# EAGLE design SD1-37 Rev1 (EAGLE 7.6.0)
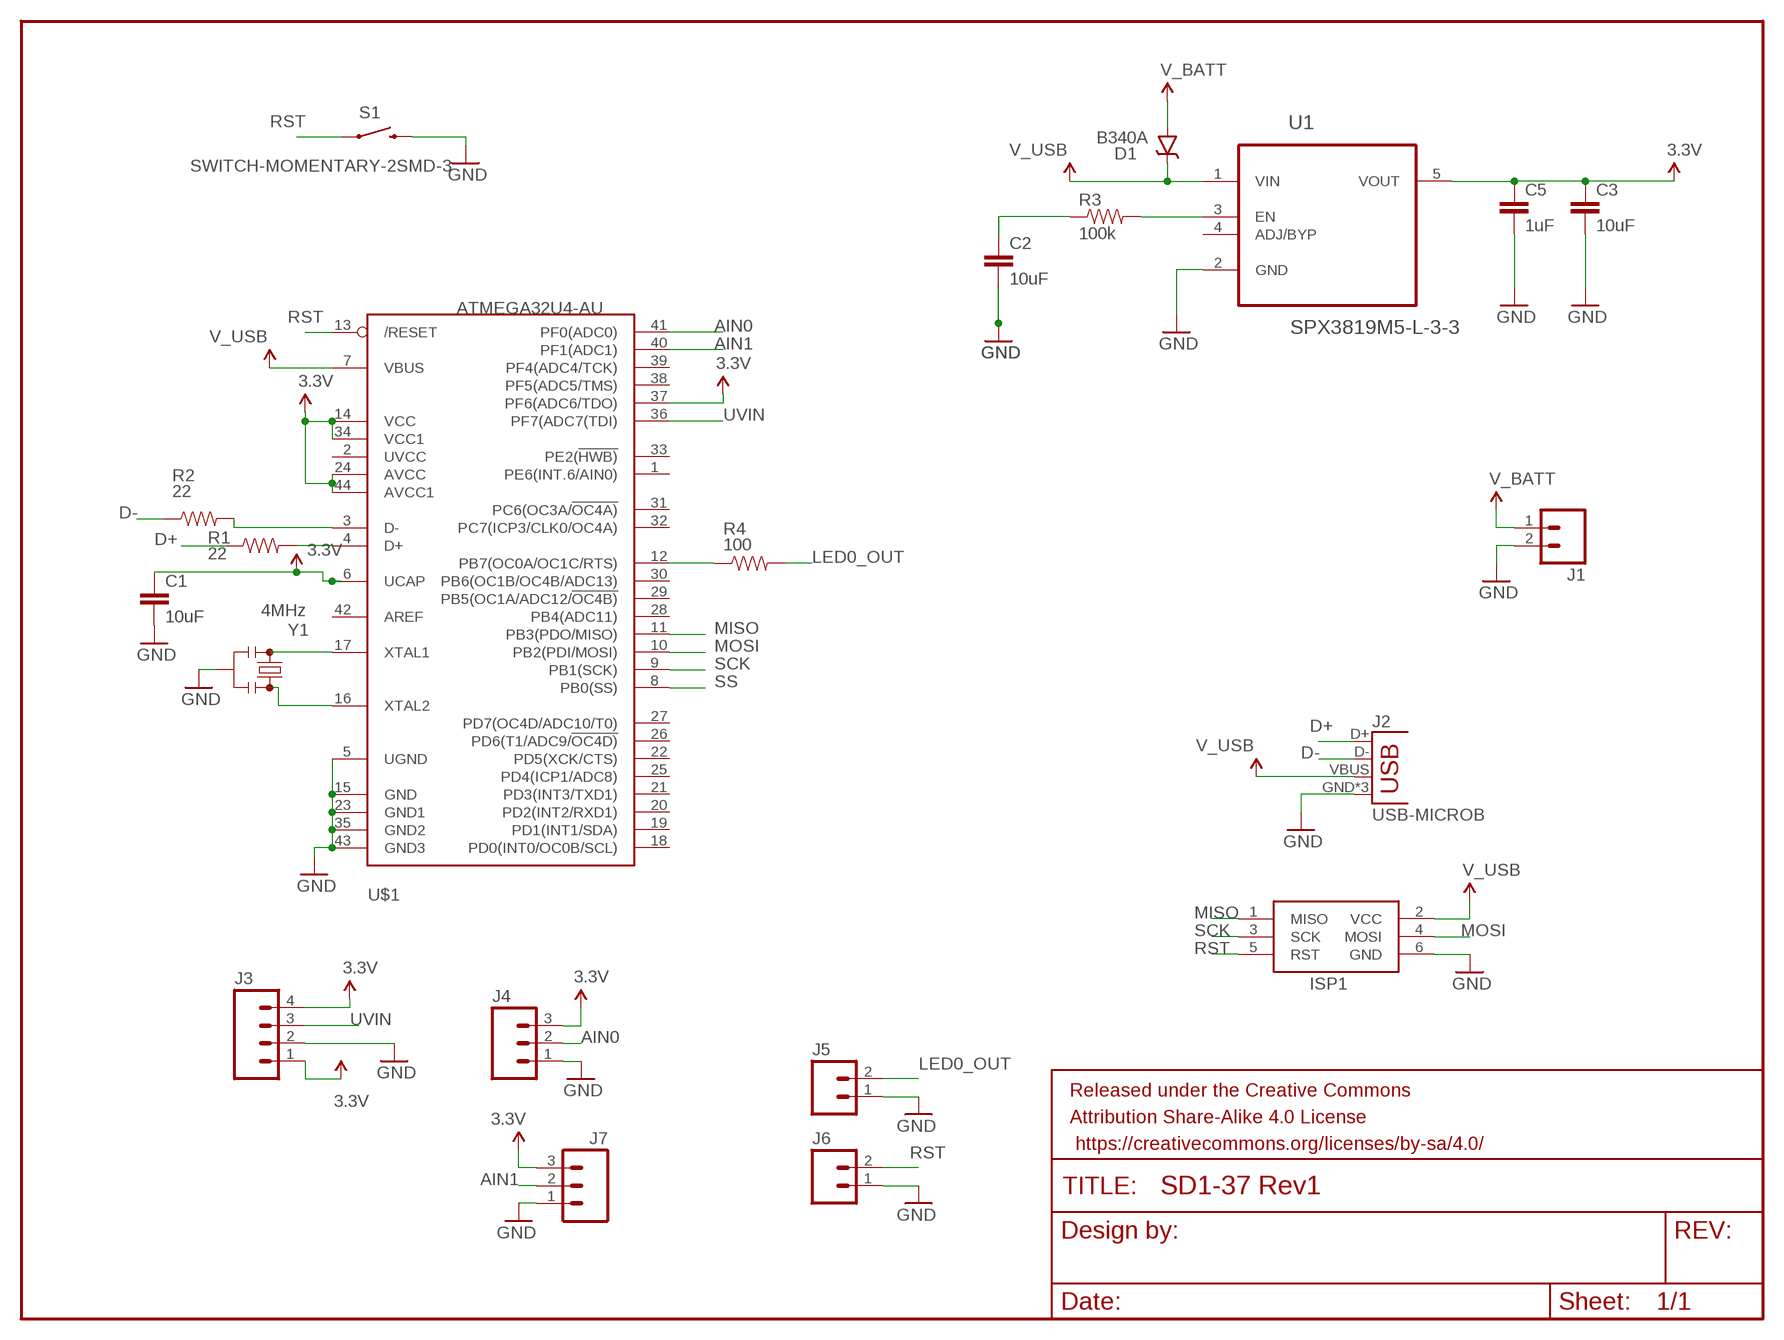
[diagram p0: schematic, sheet 1]

## Parts
C1  10uF  CAP0805  [0805]
C2  10uF  CAP0805  [0805]
C3  10uF  CAP0805  [0805]
C5  1uF  CAP0805  [0805]
D1  B340A  DIODE-SCHOTTKY-B340A  [SMA-DIODE]
FRAME1  FRAME-LETTER  [CREATIVE_COMMONS]
ISP1  AVRISP-6  [AVRISP]
J1  M02PTH  [1X02]
J2  USB-MICROB  [USB-MICROB]
J3  M04SCREW  [SCREWTERMINAL-3.5MM-4]
J4  M03SCREW  [SCREWTERMINAL-3.5MM-3]
J5  M023.5MM  [SCREWTERMINAL-3.5MM-2]
J6  M023.5MM  [SCREWTERMINAL-3.5MM-2]
J7  M03SCREW  [SCREWTERMINAL-3.5MM-3]
R1  22  RESISTOR0805-RES  [0805]
R2  22  RESISTOR0805-RES  [0805]
R3  100k  RESISTOR0805-RES  [0805]
R4  100  RESISTOR0805-RES  [0805]
S1  SWITCH-MOMENTARY-2SMD-3  [TACTILE_SWITCH_SMD-3]
U1  SPX3819M5-L-3-3  [SOT95P280X145-5N]
U$1  ATMEGA32U4-AU  [TQFP44]
Y1  4MHz  RESONATOR4MHZ  [RESONATOR-SMD_MED]

## Nets
3.3V: C1.1 C3.1 C5.1 J3.1 J3.4 J4.3 J7.3 U1.5(VOUT) U$1.6(UCAP) U$1.14(VCC) U$1.24(AVCC) U$1.34(VCC1) U$1.37(PF6(ADC6/TDO)) U$1.44(AVCC1)
AIN0: J4.2 U$1.41(PF0(ADC0))
AIN1: J7.2 U$1.40(PF1(ADC1))
D+: J2.D+ R1.1
D-: J2.D- R2.1
GND: C1.2 C2.2 C3.2 C5.2 ISP1.6(GND) J1.2 J2.GND J2.MT1(GND) J2.MT2(GND) J3.2 J4.1 J5.1 J6.1 J7.1 S1.4 U1.2(GND) U$1.5(UGND) U$1.15(GND) U$1.23(GND1) U$1.35(GND2) U$1.43(GND3) Y1.2
LED0_OUT: J5.2 R4.2
MISO: ISP1.1(MISO) U$1.11(PB3(PDO/MISO))
MOSI: ISP1.4(MOSI) U$1.10(PB2(PDI/MOSI))
N$1: R1.2 U$1.4(D+)
N$2: U$1.17(XTAL1) Y1.1
N$3: U$1.16(XTAL2) Y1.3
N$4: R2.2 U$1.3(D-)
N$5: R4.1 U$1.12(PB7(OC0A/OC1C/RTS))
N$6: R3.2 U1.3(EN)
N$7: C2.1 R3.1
RST: ISP1.5(RST) J6.2 S1.1 U$1.13(/RESET)
SCK: ISP1.3(SCK) U$1.9(PB1(SCK))
SS: U$1.8(PB0(SS))
UVIN: J3.3 U$1.36(PF7(ADC7(TDI))
V_BATT: D1.A J1.1
V_USB: D1.C ISP1.2(VCC) J2.VBUS U1.1(VIN) U$1.7(VBUS)
Unconnected: U1.4(ADJ/BYP) U$1.1(PE6(INT.6/AIN0)) U$1.2(UVCC) U$1.18(PD0(INT0/OC0B/SCL)) U$1.19(PD1(INT1/SDA)) U$1.20(PD2(INT2/RXD1)) U$1.21(PD3(INT3/TXD1)) U$1.22(PD5(XCK/CTS)) U$1.25(PD4(ICP1/ADC8)) U$1.26(PD6(T1/ADC9/!OC4D)) U$1.27(PD7(OC4D/ADC10/T0)) U$1.28(PB4(ADC11)) U$1.29(PB5(OC1A/ADC12/!OC4B)) U$1.30(PB6(OC1B/OC4B/ADC13)) U$1.31(PC6(OC3A/!OC4A)) U$1.32(PC7(ICP3/CLK0/OC4A)) U$1.33(PE2(!HWB)) U$1.38(PF5(ADC5/TMS)) U$1.39(PF4(ADC4/TCK)) U$1.42(AREF)

## Library data of the parts
C1-C3 C5 = SparkFun-Capacitors:CAP: Capacitor Standard 0603 ceramic capacitor, and 0.1" leaded capacitor.
D1 = SparkFun-DiscreteSemi:DIODE-SCHOTTKY: Schottky diodes in SFE's production catalog BAT20J 1A 23V 0.62Vf RB751 120mA 40V 0.37Vf PMEG4005EJ 0.5A 40V 0.42Vf MBRA140 1A 40V 0.5Vf B340A 3A 40V SMA; PROD_ID: DIO-09886
FRAME1 = SparkFun-Aesthetics:FRAME-LETTER: Schematic Frame Standard 8.5x11 US Letter frame
ISP1 = adafruit:AVRISP: AVR ISP HEADER Standard 6 pin header for AVR programming
J1 = SparkFun-Connectors:M02: Standard 2-pin 0.1" header. Use with - straight break away headers ( PRT-00116) - right angle break away headers (PRT-00553) - swiss pins (PRT-00743) - machine pins (PRT-00117) - female headers (PRT-00115) Molex polarized connector foot print use with: PRT-08233 with associated crimp pins and housings. 2.54_SCREWTERM for use with PRT-10571. 3.5mm Screw Terminal footprints for PRT-08084 5mm Screw Terminal footprints for use with PRT-08432
J2 = SparkFun-Connectors:USB: USB Connectors USB-B-PTH is fully proven SKU : PRT-00139/CONN-08278 USB-miniB is fully proven SKU : PRT-00587 USB-A-PCB is untested. USB-A-H is throughly reviewed, but untested. Spark Fun Electronics SKU : PRT-00437 USB-B-SMT is throughly reviewed, but untested. Needs silkscreen touching up. USB-A-S has not been used/tested USB-MB-H has not been used/tested USB-MICROB has been used. CONN-09505; PROD_ID: CONN-09505
J3 = SparkFun-Connectors:M04: Header 4 Standard 4-pin 0.1" header. Use with straight break away headers (SKU : PRT-00116), right angle break away headers (PRT-00553), swiss pins (PRT-00743), machine pins (PRT-00117), and female headers (PRT-00115). Molex polarized connector foot print use with SKU : PRT-08231 with associated crimp pins and housings. 1MM SMD Version SKU: PRT-10208; PROD_ID: Combine 2x8399
J4 J7 = SparkFun-Connectors:M03: Header 3 Standard 3-pin 0.1" header. Use with straight break away headers (SKU : PRT-00116), right angle break away headers (PRT-00553), swiss pins (PRT-00743), machine pins (PRT-00117), and female headers (PRT-00115). Molex polarized connector foot print use with SKU : PRT-08232 with associated crimp pins and housings.; PROD_ID: CONN-08288
J5 J6 = SparkFun-Connectors:M02: Standard 2-pin 0.1" header. Use with - straight break away headers ( PRT-00116) - right angle break away headers (PRT-00553) - swiss pins (PRT-00743) - machine pins (PRT-00117) - female headers (PRT-00115) Molex polarized connector foot print use with: PRT-08233 with associated crimp pins and housings. 2.54_SCREWTERM for use with PRT-10571. 3.5mm Screw Terminal footprints for PRT-08084 5mm Screw Terminal footprints for use with PRT-08432; PROD_ID: CONN-08399
R1 R2 R4 = SparkFun-Passives:RESISTOR: Resistor Basic schematic elements and footprints for 0603, 1206, and PTH resistors.
R3 = SparkFun-Resistors:RESISTOR: Resistor Basic schematic elements and footprints for 0603, 1206, and PTH resistors.
S1 = SparkFun-Electromechanical:SWITCH-MOMENTARY-2: Various NO switches- pushbuttons, reed, etc
U1 = Exar_By_element14_Batch_1:SPX3819M5-L-3-3: 500mA, LOW-NOISE LDO VOLTAGE REGULATOR; MPN: SPX3819M5-L-3-3; OC_FARNELL: 1831949; OC_NEWARK: 23R9702; PACKAGE: SOT-23-5; SUPPLIER: EXAR
U$1 = adafruit:ATMEGA32U4: http://www.ladyada.net/library/eagle
Y1 = SparkFun-FreqCtrl:RESONATOR: Resonator Small SMD resonator. Used, eg, on the Arduino Pro/ Pro Mini boards. 8MHz- XTAL-08895 16MHz- XTAL-08900; PROD_ID: XTAL-12492

## Board
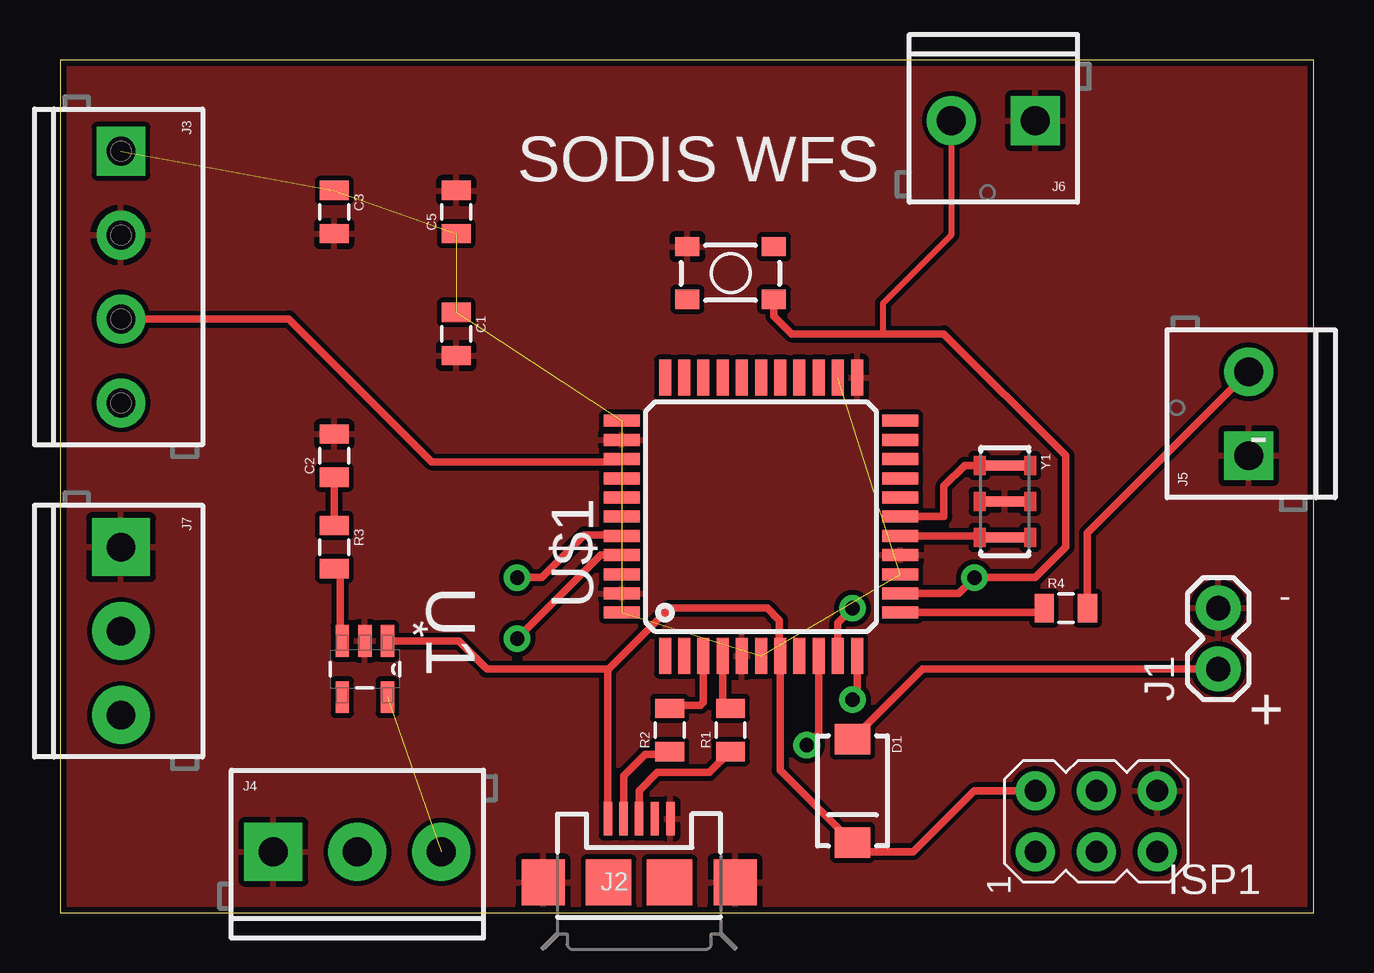
[diagram p1: board, top side]
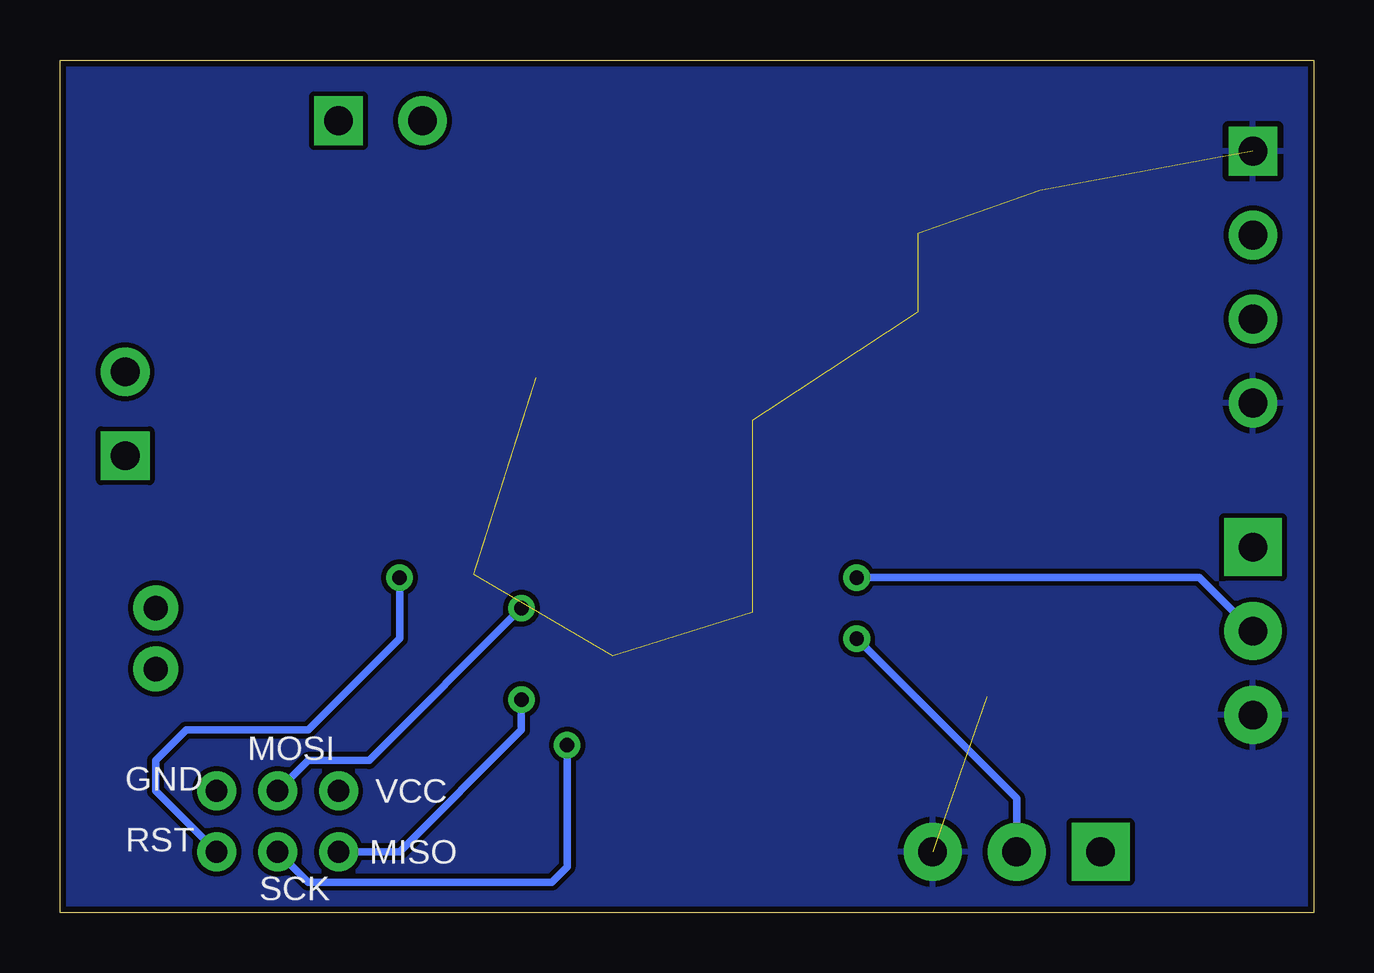
[diagram p2: board, bottom side, seen from below]

Size 52.25 x 35.55 mm. Coordinates in mm from the lower left corner, seen from the top.
Outline: 0,0 52.25,0 52.25,35.55 0,35.55 0,0
Copper layers (1*16): Top 0.035mm / dielectric 1.5mm / Bottom 0.035mm
Design rules "SparkFun": minimum track width 8mil, minimum drill 20mil, track to track 8mil, track to pad 8mil, pad to pad 8mil, via to via 8mil, smd to smd 8mil, copper to edge 10mil, drill to drill 8mil, minimum pad ring 12mil, minimum via ring 10mil, stop-mask expansion 4mil, vias tented up to drill 25mil, thermal gap 10mil

### Footprints (pad centres in the part's own frame; a part is rotated, then mirrored left to right if it is on the bottom)
0805 = smd 0.8 x 1.2: 1 -0.9,0; 2 0.9,0
SMA-DIODE = smd 1.27 x 1.47: A -2.15,0; C 2.15,0
AVRISP = drill 0.9 pad 1.626: 1 -1.27,2.54; 2 1.27,2.54; 3 -1.27,0; 4 1.27,0; 5 -1.27,-2.54; 6 1.27,-2.54
1X02 = drill 1.016 pad 1.88: 1 0,0; 2 2.54,0
USB-MICROB = smd 0.35 x 1.4: D+ 0,2.65; D- -0.65,2.65; GND 1.3,2.65; ID 0.65,2.65; VBUS -1.3,2.65 | smd 1.8 x 1.9: MT1 -4,0; MT2 4,0 | smd 1.9 x 1.9: P$1 -1.27,0; P$2 1.27,0
SCREWTERMINAL-3.5MM-4 = drill 1.2 pad 2.032 square: 1 0,0 | drill 1.2 pad 2.032: 2 3.5,0; 3 7,0; 4 10.5,0
SCREWTERMINAL-3.5MM-3 = drill 1.2 pad 2.413 square: 1 0,0 | drill 1.2 pad 2.413: 2 3.5,0; 3 7,0
SCREWTERMINAL-3.5MM-2 = drill 1.2 pad 2.032 square: 1 0,0 | drill 1.2 pad 2.032: 2 3.5,0
TACTILE_SWITCH_SMD-3 = smd 1 x 0.8: 1 -1.8,1.1; 2 1.8,1.1; 3 -1.8,-1.1; 4 1.8,-1.1
SOT95P280X145-5N = smd 1.321 x 0.559: 1 -1.168,0.94; 2 -1.168,0; 3 -1.168,-0.94; 4 1.168,-0.94; 5 1.168,0.94
TQFP44 = smd 1.5 x 0.5: 1 -5.8,4; 2 -5.8,3.2; 3 -5.8,2.4; 4 -5.8,1.6; 5 -5.8,0.8; 6 -5.8,0; 7 -5.8,-0.8; 8 -5.8,-1.6; 9 -5.8,-2.4; 10 -5.8,-3.2; 11 -5.8,-4; 23 5.8,-4; 24 5.8,-3.2; 25 5.8,-2.4; 26 5.8,-1.6; 27 5.8,-0.8; 28 5.8,0; 29 5.8,0.8; 30 5.8,1.6; 31 5.8,2.4; 32 5.8,3.2; 33 5.8,4 | smd 0.5 x 1.5: 12 -4,-5.8; 13 -3.2,-5.8; 14 -2.4,-5.8; 15 -1.6,-5.8; 16 -0.8,-5.8; 17 0,-5.8; 18 0.8,-5.8; 19 1.6,-5.8; 20 2.4,-5.8; 21 3.2,-5.8; 22 4,-5.8; 34 4,5.8; 35 3.2,5.8; 36 2.4,5.8; 37 1.6,5.8; 38 0.8,5.8; 39 0,5.8; 40 -0.8,5.8; 41 -1.6,5.8; 42 -2.4,5.8; 43 -3.2,5.8; 44 -4,5.8
RESONATOR-SMD_MED = smd 0.4 x 1.6: 1 -1.5,0; 2 0,0; 3 1.5,0

### Placement (x,y rotation side)
C1  16.51,24.13 270 top
C2  11.43,19.05 90 top
C3  11.43,29.21 270 top
C5  16.51,29.21 90 top
D1  33.02,5.08 270 top
FRAME1  -101.6,30.48 0 top  (outside the outline)
ISP1  43.18,3.81 90 top
J1  48.26,10.16 90 top
J2  24.13,1.27 0 top
J3  2.54,31.75 270 top
J4  8.89,2.54 0 top
J5  49.53,19.05 90 top
J6  40.64,33.02 180 top
J7  2.54,15.24 270 top
R1  27.94,7.62 90 top
R2  25.4,7.62 90 top
R3  11.43,15.24 270 top
R4  41.91,12.7 0 top
S1  27.94,26.67 180 top
U1  12.7,10.16 270 top
U$1  29.21,16.51 90 top
Y1  39.37,17.14 270 top

### Tracks (layer width: path | path; a pad name or v marks a point on that pad's centre or on a via)
3.3V  (10 unrouted)
  pour Bottom: 0,35.56 0,0 52.07,0 52.07,35.56
AIN0  (via drill 0.6)
  Top 0.305: U$1.41 22.53,14.91 v19.05,11.43
  Bottom 0.305: v19.05,11.43 12.39,4.77 J4.2
AIN1  (via drill 0.6)
  Top 0.305: v19.05,13.97 20.07,13.97 21.84,15.75 23.37,15.75 U$1.40
  Bottom 0.305: J7.2 4.77,13.97 v19.05,13.97
D+
  Top 0.305: J2.D+ 24.13,5.08 24.89,5.84 27.06,5.84 R1.1
D-
  Top 0.305: J2.D- 23.48,5.7 24.38,6.6 25.28,6.6 R2.1
GND
  pour Top: 0,35.56 0,0 52.07,0 52.07,35.56
LED0_OUT
  Top 0.305: J5.2 42.81,15.83 R4.2
MISO  (via drill 0.6)
  Top 0.305: U$1.11 33.21,9.08 v33.02,8.89
  Bottom 0.305: v33.02,8.89 33.02,7.62 38.1,2.54 ISP1.1
MOSI  (via drill 0.6)
  Top 0.305: U$1.10 32.41,12.09 v33.02,12.7
  Bottom 0.305: v33.02,12.7 39.37,6.35 41.91,6.35 ISP1.4
N$1
  Top 0.305: U$1.4 27.61,8.85 R1.2
N$2
  Top 0.305: U$1.17 36.83,16.51 36.83,17.78 37.7,18.64 Y1.1
N$3
  Top 0.305: U$1.16 39.3,15.71 Y1.3
N$4
  Top 0.305: U$1.3 26.81,8.78 26.67,8.64 25.52,8.64 R2.2
N$5
  Top 0.305: U$1.12 40.82,12.51 R4.1
N$6
  Top 0.305: U1.3 11.68,11.4 11.68,14.09 R3.2
N$7
  Top 0.305: R3.1 C2.1
RST  (via drill 0.6)
  Top 0.254: J6.2 37.14,28.25 34.29,25.4 34.29,24.13
  Top 0.305: U$1.13 37.44,13.31 v38.1,13.97 40.64,13.97 41.91,15.24 41.91,19.05 36.83,24.13 34.29,24.13 30.48,24.13 29.74,24.87 S1.1
  Bottom 0.305: ISP1.5 48.26,5.08 48.26,6.35 46.99,7.62 41.91,7.62 38.1,11.43 v38.1,13.97
SCK  (via drill 0.6)
  Top 0.305: U$1.9 31.61,7.48 v31.11,6.99
  Bottom 0.305: v31.11,6.99 31.11,1.91 31.75,1.27 41.91,1.27 ISP1.3
UVIN
  Top 0.305: J3.3 9.54,24.75 15.49,18.8 23.3,18.8 U$1.36
V_BATT
  Top 0.305: D1.A 35.95,10.16 J1.1
V_USB
  Top 0.305: ISP1.2 38.1,5.08 35.56,2.54 33.41,2.54 D1.C 30.01,5.94 U$1.7 29.97,10.75 29.97,12.19 29.46,12.7 25.4,12.7 22.83,10.13 | U1.1 16.61,11.33 17.78,10.16 22.8,10.16 22.83,10.13 | 22.86,3.95 J2.VBUS 22.83,10.13

### Text on the board
tPlace: SODIS WFS | - | - | +
bPlace: MOSI | VCC | GND | RST | MISO | SCK